# EAGLE schematic Active_Bandpass_Filter (EAGLE 7.5.0)
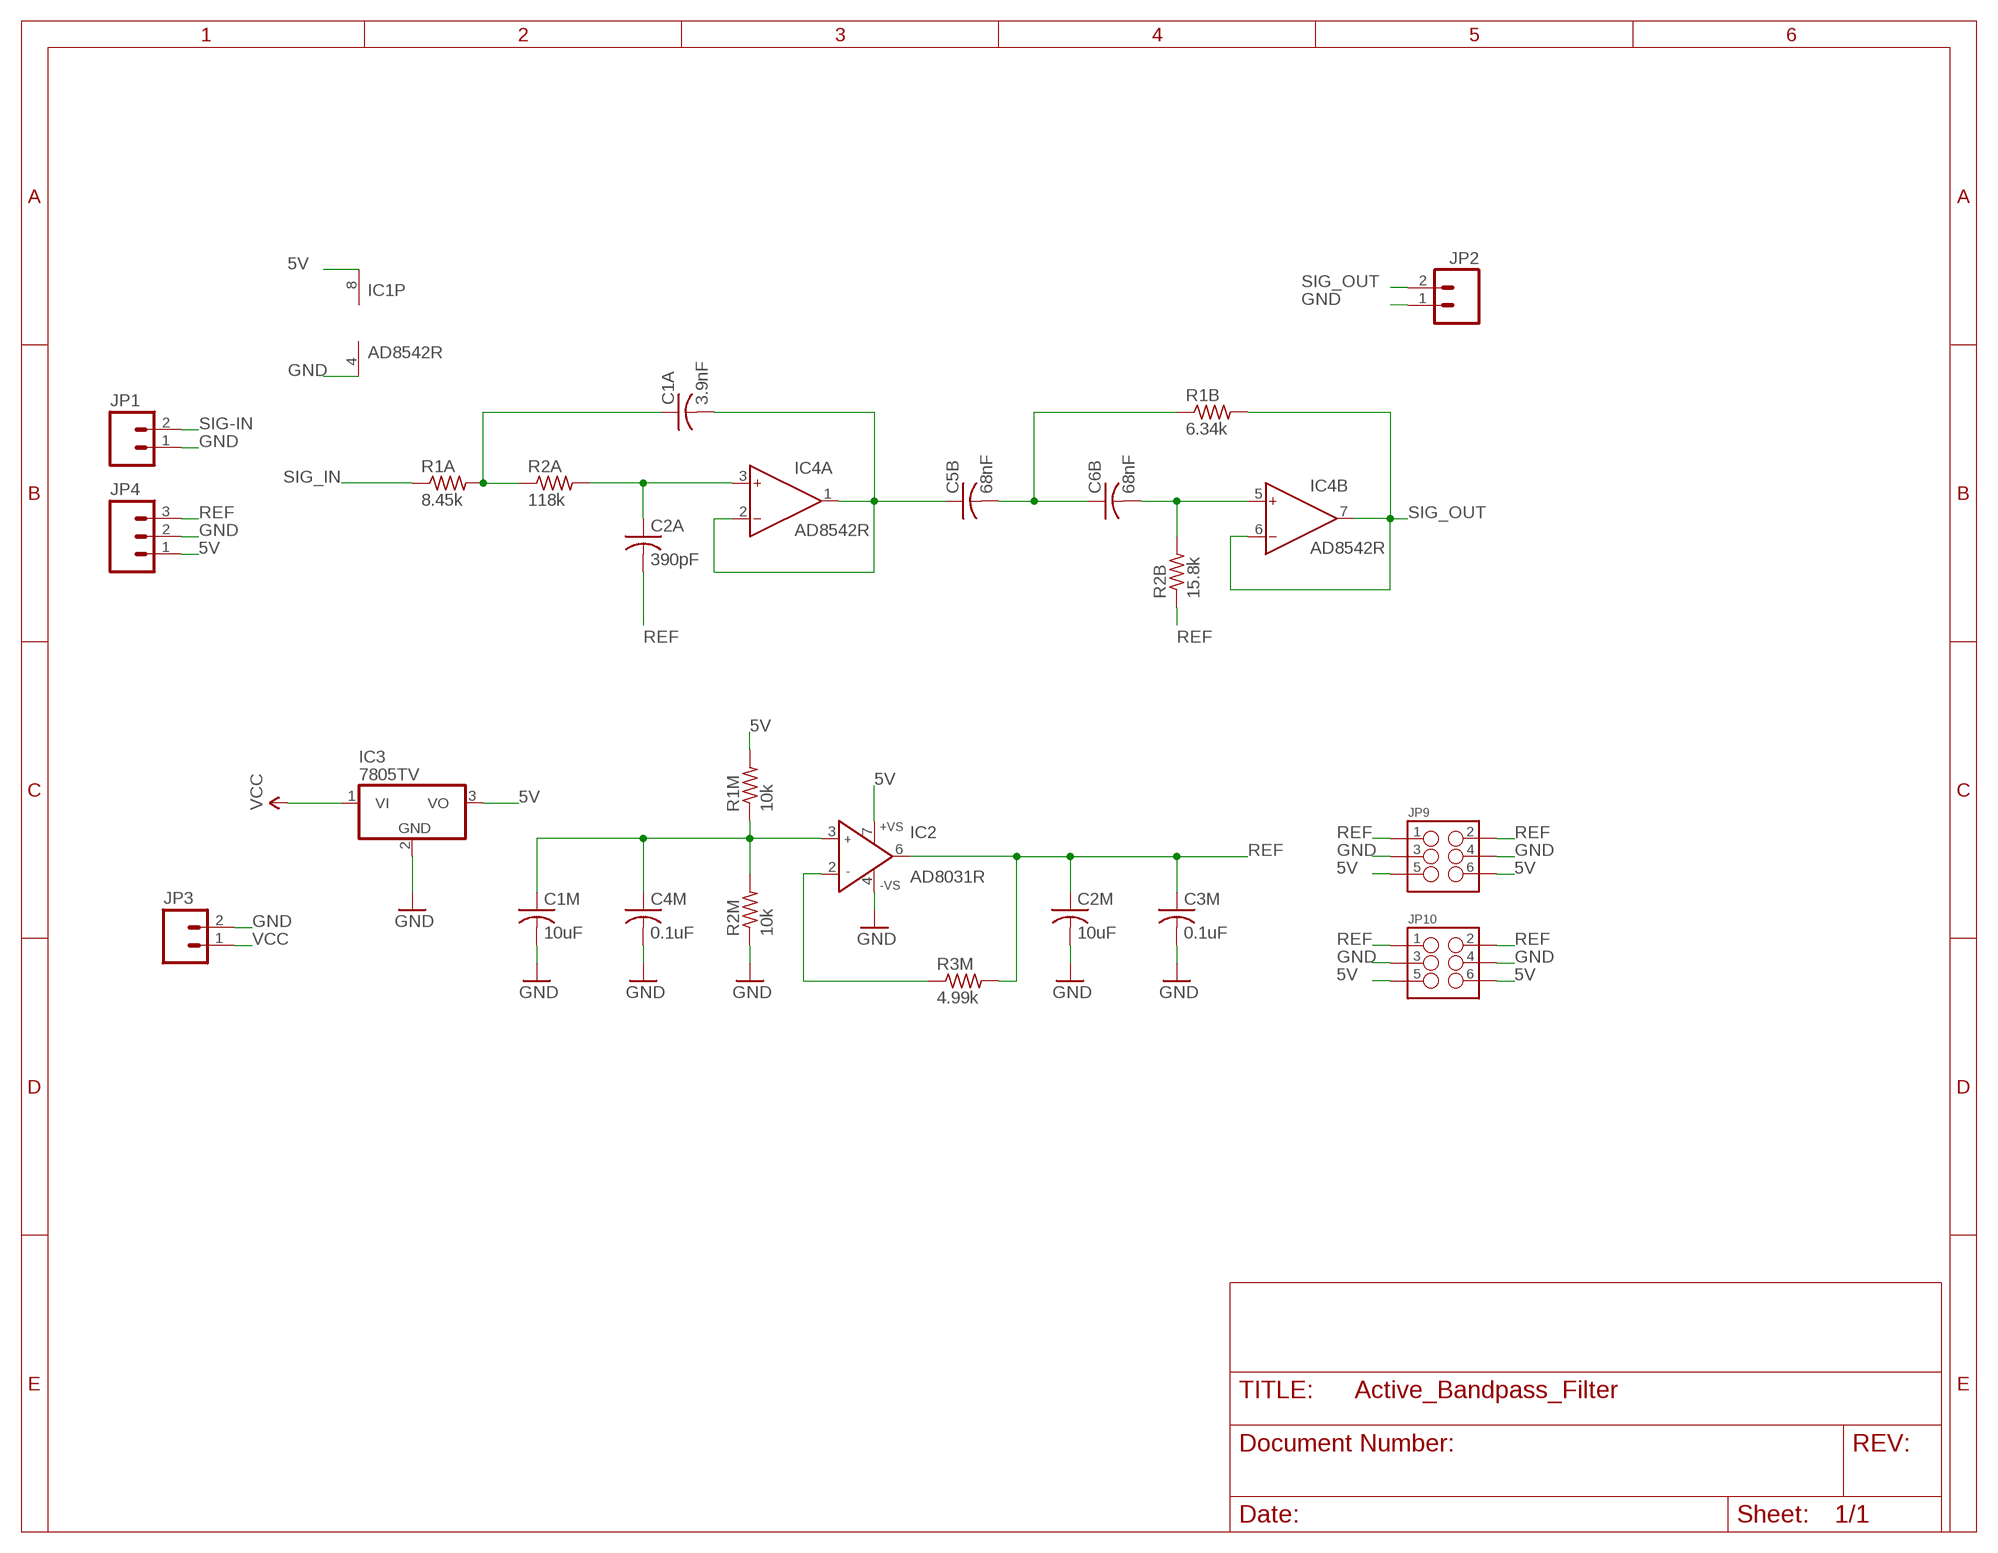
[diagram p0: schematic, sheet 1]

## Parts
C1A  3.9nF  C-USC1206  [C1206]
C1M  10uF  C-USC1206  [C1206]
C2A  390pF  C-USC1206  [C1206]
C2M  10uF  C-USC1206  [C1206]
C3M  0.1uF  C-USC1206  [C1206]
C4M  0.1uF  C-USC1206  [C1206]
C5B  68nF  C-USC1206  [C1206]
C6B  68nF  C-USC1206  [C1206]
IC1  AD8542R  [SO8]
IC2  AD8031R  [SO8]
IC3  7805TV  [TO220V]
IC4  AD8542R  [SO8]
JP1  M02LOCK_LONGPADS  [1X02_LOCK_LONGPADS]
JP2  M02LOCK_LONGPADS  [1X02_LOCK_LONGPADS]
JP3  M02LOCK_LONGPADS  [1X02_LOCK_LONGPADS]
JP4  M03LOCK_LONGPADS  [1X03_LOCK_LONGPADS]
JP9  M03X22X3_SILK_MALE_PTH  [2X3]
JP10  M03X22X3_SILK_MALE_PTH  [2X3]
R1A  8.45k  R-US_R1206  [R1206]
R1B  6.34k  R-US_R1206  [R1206]
R1M  10k  R-US_R1206  [R1206]
R2A  118k  R-US_R1206  [R1206]
R2B  15.8k  R-US_R1206  [R1206]
R2M  10k  R-US_R1206  [R1206]
R3M  4.99k  R-US_R1206  [R1206]

## Nets
5V: IC1.8(P:V+) IC2.7(+VS) IC3.3(VO) JP4.1 JP9.5 JP9.6 JP10.5 JP10.6 R1M.2
GND: C1M.2 C2M.2 C3M.2 C4M.2 IC1.4(P:V-) IC2.4(-VS) IC3.2(GND) JP1.1 JP2.1 JP3.2 JP4.2 JP9.3 JP9.4 JP10.3 JP10.4 R2M.1
N$1: C1A.1 R1A.2 R2A.1
N$2: C2A.1 IC4.3(A:IN+) R2A.2
N$3: C1A.2 IC4.2(A:IN-)
N$4: C5B.2 C6B.1 R1B.1
N$5: C6B.2 IC4.5(B:IN+) R2B.2
N$7: C5B.1 IC4.1(A:OUT)
N$8: C1M.1 C4M.1 IC2.3(IN+) R1M.1 R2M.2
N$12: IC2.2(IN-) R3M.1
REF: C2A.2 C2M.1 C3M.1 IC2.6(OUT) JP4.3 JP9.1 JP9.2 JP10.1 JP10.2 R2B.1 R3M.2
SIG-IN: JP1.2
SIG_IN: R1A.1
SIG_OUT: IC4.6(B:IN-) IC4.7(B:OUT) JP2.2 R1B.2
VCC: IC3.1(VI) JP3.1
Unconnected: IC1.1(A:OUT) IC1.2(A:IN-) IC1.3(A:IN+) IC1.5(B:IN+) IC1.6(B:IN-) IC1.7(B:OUT)

## Power pins joined to a net without a drawn wire
V+: IC4.8(P:V+)
V-: IC4.4(P:V-)

## Library data of the parts
C1A C1M C2A C2M C3M C4M C5B C6B = resistor:C-US: CAPACITOR, American symbol
IC1 IC4 = analog-devices:AD8542: General-Purpose CMOS Rail-to-Rail Amplifiers Source: http://www.analog.com/static/imported-files/data_sheets/AD8541_8542_8544.pdf; MF: ALTERA CORPORATION; MPN: AD8542ARZ-REEL; OC_FARNELL: 1424150; OC_NEWARK: 59K6827
IC2 = analog-devices:AD8031: 2.7 V, 800 ?A, 80 MHz Rail-to-Rail I/O Amplifiers Source: http://www.analog.com/static/imported-files/data_sheets/AD8031_8032.pdf; MPN: AD8031ARZ; OC_FARNELL: 8621500; OC_NEWARK: 19M0917
IC3 = linear:78*: Positive VOLTAGE REGULATOR Source: http://cache.national.com/ds/LM/LM78L05.pdf http://www.fairchildsemi.com/ds/LM/LM7805.pdf
JP1-JP3 = SparkFun-Connectors:M02: Standard 2-pin 0.1" header. Use with - straight break away headers ( PRT-00116) - right angle break away headers (PRT-00553) - swiss pins (PRT-00743) - machine pins (PRT-00117) - female headers (PRT-00115) Molex polarized connector foot print use with: PRT-08233 with associated crimp pins and housings. 2.54_SCREWTERM for use with PRT-10571. 3.5mm Screw Terminal footprints for PRT-08084 5mm Screw Terminal footprints for use with PRT-08432
JP4 = SparkFun-Connectors:M03: Header 3 Standard 3-pin 0.1" header. Use with straight break away headers (SKU : PRT-00116), right angle break away headers (PRT-00553), swiss pins (PRT-00743), machine pins (PRT-00117), and female headers (PRT-00115). Molex polarized connector foot print use with SKU : PRT-08232 with associated crimp pins and housings.
JP9 JP10 = SparkFun-Connectors:M03X2: 2x3 .1" header. Shrouded, with keying- CONN-10681 SMT- CONN-11415 Pogo pins- HW-11044; PROD_ID: CONN-09701
R1A R1B R1M R2A R2B R2M = resistor:R-US_: RESISTOR, American symbol
R3M = rcl:R-US_: RESISTOR, American symbol